# Altium schematic sheet _temperature.SchDoc
size Tabloid
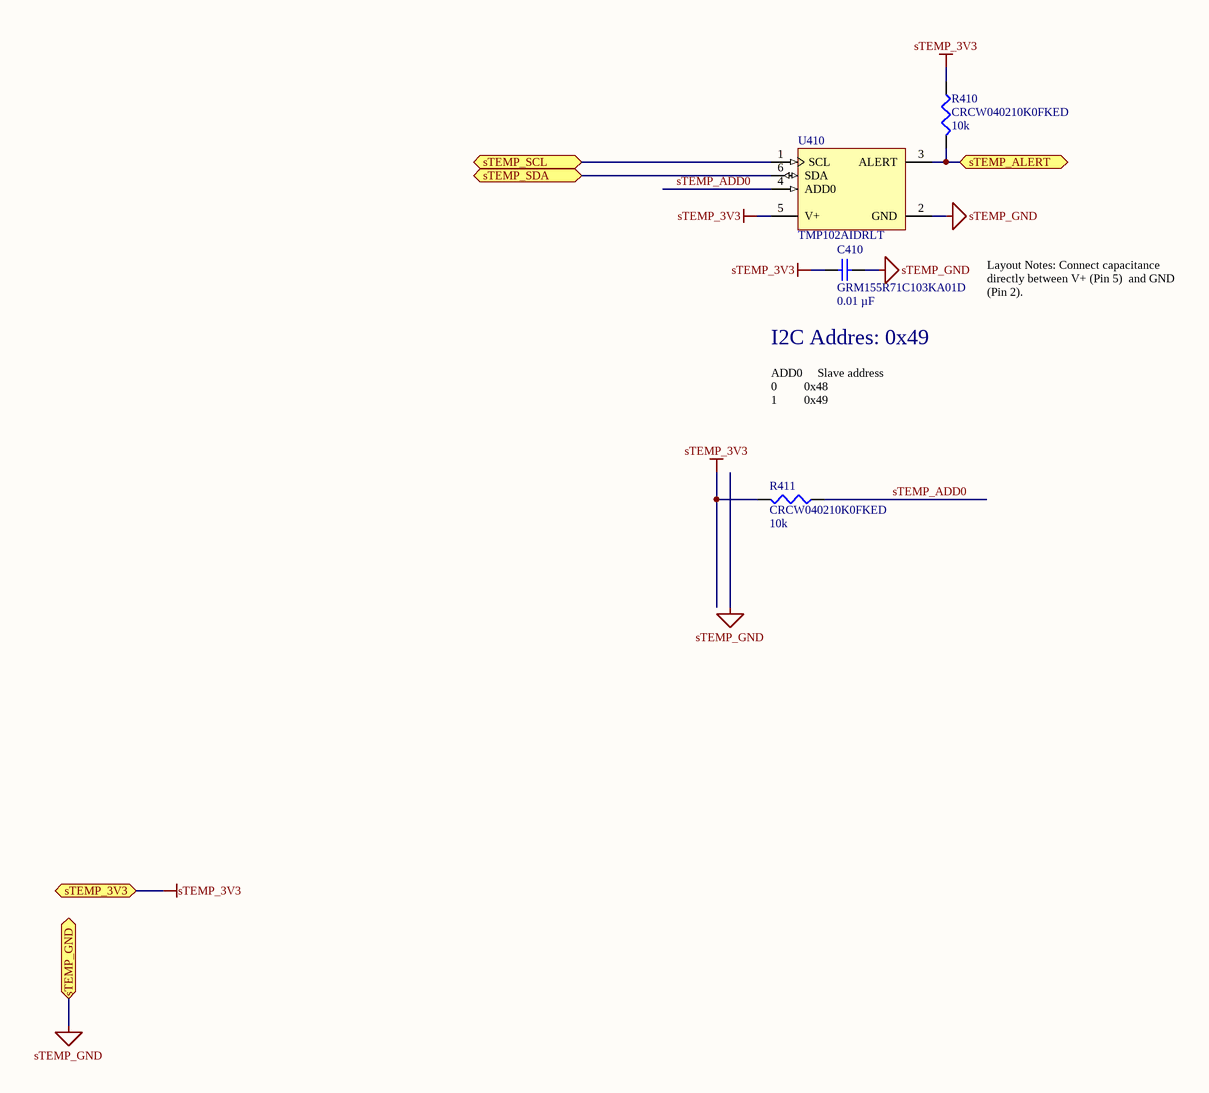
[diagram p0: _temperature.SchDoc]

## Parts
C410  GRM155R71C103KA01D  value 0.01 µF  [0402]
R410  CRCW040210K0FKED  value 10k  [0402]
R411  CRCW040210K0FKED  value 10k  [0402]
U410  TMP102AIDRLT  [DRL0006A_L]

## Ports
sTEMP_3V3, sTEMP_ALERT, sTEMP_GND, sTEMP_SCL, sTEMP_SDA

## Nets
sTEMP_3V3: C410.2 R410.1 R411.2 U410.5(V+) ; port sTEMP_3V3
sTEMP_GND: C410.1 U410.2(GND) ; port sTEMP_GND
sTEMP_ADD0: R411.1 U410.4(ADD0)
sTEMP_ALERT: R410.2 U410.3(ALERT) ; port sTEMP_ALERT
sTEMP_SCL: U410.1(SCL) ; port sTEMP_SCL
sTEMP_SDA: U410.6(SDA) ; port sTEMP_SDA

## Notes on the sheet
- Layout Notes: Connect capacitance directly between V+ (Pin 5)  and GND (Pin 2).
- I2C Addres: 0x49
- ADD0     Slave address
  0         0x48
  1         0x49

## Library data of the parts
C410 = Cap: Cap, 0.01 µF, 16 V, X7R; Published: 8-Jun-2000; LatestRevisionDate: 17-Jul-2002; LatestRevisionNote: Re-released for DXP Platform.; PackageReference: RAD-0.3; Publisher: Altium Limited; PackageDescription: Radial Cap, Thru-Hole; 2 Leads; 0.3 in Pin Spacing
R410 R411 = CRCW0402xxxxFKED: 0.125W, -55-155C, 1005, 50V, ±1%
U410 = CMP-1685-00013-1: Low Power Digital Temperature Sensor with SMBus and Two-Wire Serial Interface, 1.4 to 3.6 V, -40 to 125 degC, 6-Pin SOT (DRL), Green (RoHS & no Sb/Br), Tape and Reel; ComponentLink3URL: http://www.ti.com/lit/ml/mpds159c/mpds159c.pdf; PackageVersion: 4205622-3/D, 08/2207; ComponentLink2Description: Datasheet; PackageReference: DRL0006A; ComponentLink2URL: http://www.ti.com/lit/ds/symlink/tmp102.pdf; ComponentLink3Description: Package Specification; ComponentLink1Description: Manufacturer URL; DatasheetVersion: SBOS397F, 12/2015; PackageDescription: 6-Pin Plastic Small Outline, Body 1.6 x 1.2 mm, Pitch 0.5 mm; ComponentLink1URL: http://www.ti.com/